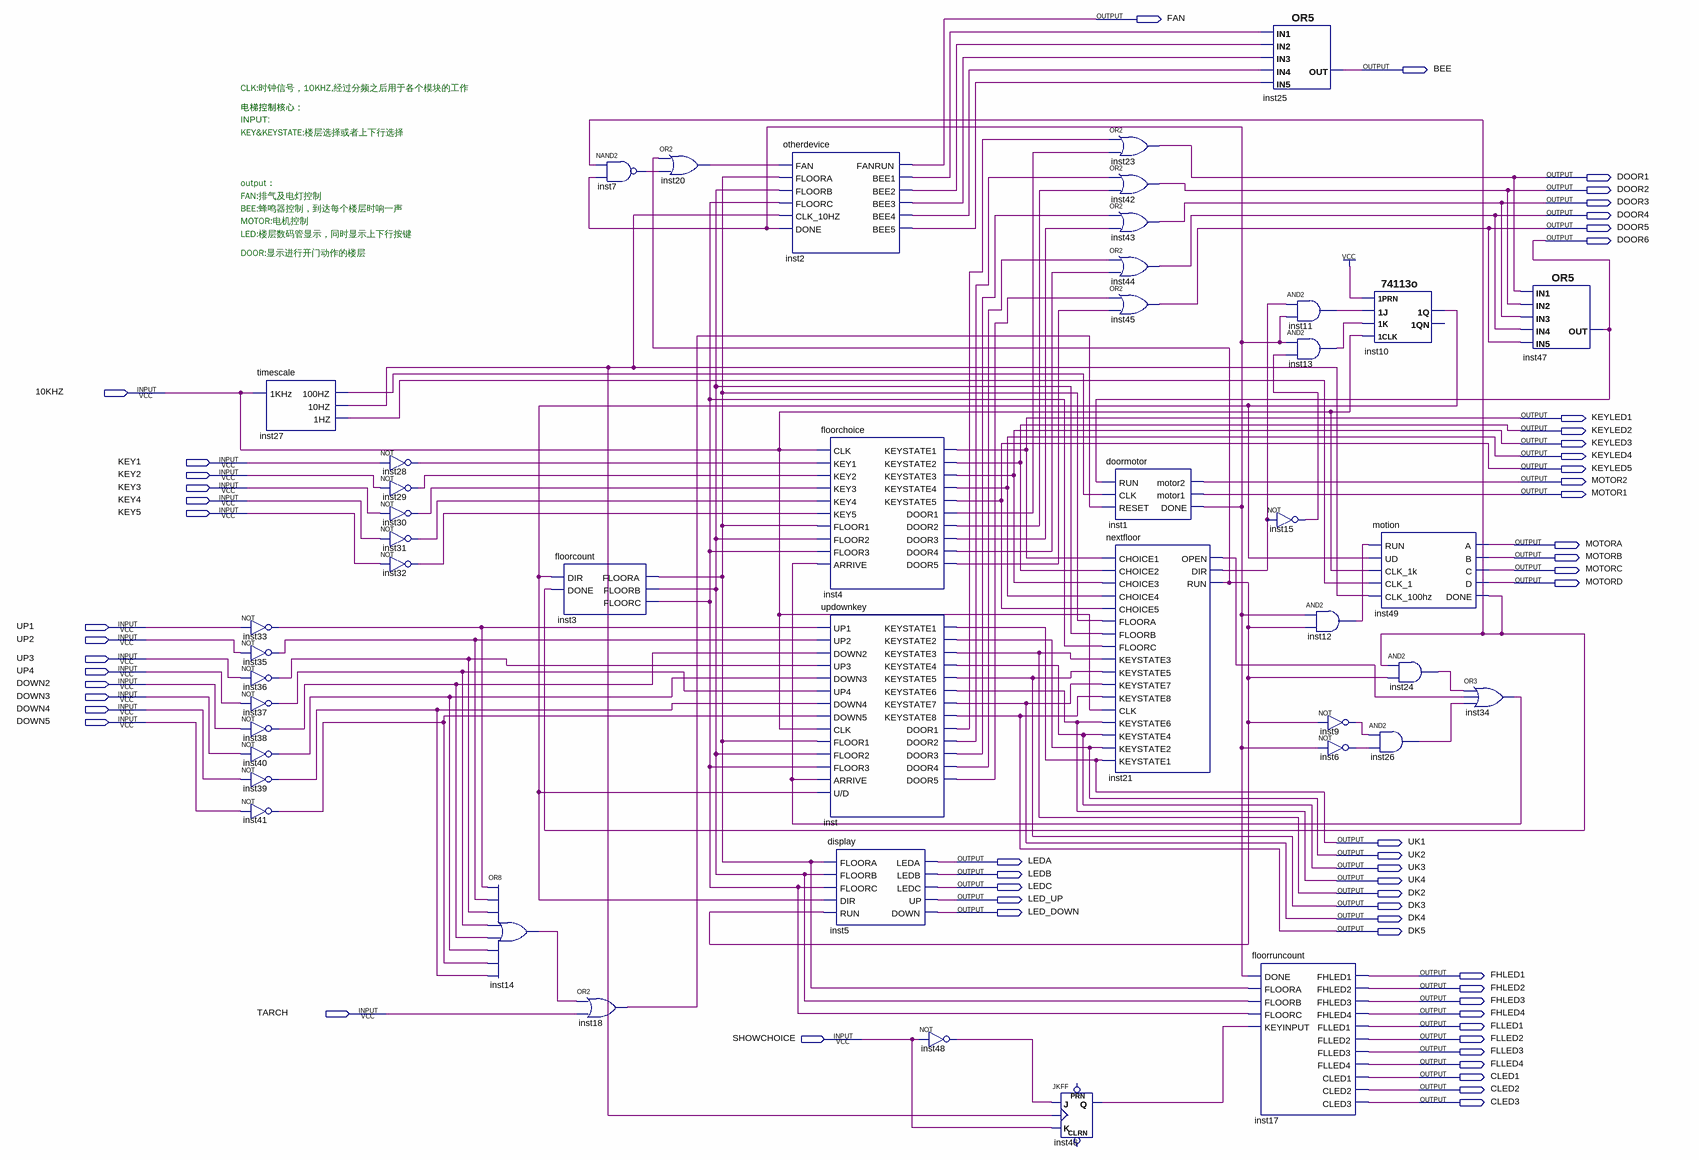
[diagram p0: schematic sheet]
// Quartus schematic elevator.bdf as structural Verilog: 46 symbols, 59 pins
module elevator (
  input  \10KHZ ,
  input  KEY1,
  input  KEY2,
  input  KEY3,
  input  KEY4,
  input  KEY5,
  input  UP1,
  input  UP2,
  input  UP3,
  input  UP4,
  input  DOWN2,
  input  DOWN3,
  input  DOWN4,
  input  DOWN5,
  input  TARCH,
  input  SHOWCHOICE,
  output FAN,
  output BEE,
  output DOOR1,
  output DOOR2,
  output DOOR3,
  output DOOR4,
  output DOOR5,
  output DOOR6,
  output KEYLED1,
  output KEYLED2,
  output KEYLED3,
  output KEYLED4,
  output KEYLED5,
  output MOTOR2,
  output MOTOR1,
  output MOTORA,
  output MOTORB,
  output MOTORC,
  output MOTORD,
  output UK1,
  output UK2,
  output LEDA,
  output UK3,
  output LEDB,
  output UK4,
  output LEDC,
  output DK2,
  output LED_UP,
  output DK3,
  output LED_DOWN,
  output DK4,
  output DK5,
  output FHLED1,
  output FHLED2,
  output FHLED3,
  output FHLED4,
  output FLLED1,
  output FLLED2,
  output FLLED3,
  output FLLED4,
  output CLED1,
  output CLED2,
  output CLED3
);

  wire inst1_done, inst2_bee1, inst2_bee2, inst2_bee3, inst2_bee4, inst2_bee5, inst3_floora, inst3_floorb,
       inst3_floorc, inst4_door1, inst4_door2, inst4_door3, inst4_door4, inst4_door5, inst6_out, inst7_out,
       inst9_out, inst10_1q, inst11_out, inst12_out, inst13_out, inst14_out, inst15_out, inst18_out,
       inst20_out, inst21_dir, inst21_open, inst21_run, inst24_out, inst26_out, inst27_1hz, inst27_10hz,
       inst27_100hz, inst28_out, inst29_out, inst30_out, inst31_out, inst32_out, inst33_out, inst34_out,
       inst35_out, inst36_out, inst37_out, inst38_out, inst39_out, inst40_out, inst41_out, inst46_q,
       inst48_out, inst49_done, inst_door1, inst_door2, inst_door3, inst_door4, inst_door5;

  timescale inst27 (.\1KHz (\10KHZ ), .\100HZ (inst27_100hz), .\10HZ (inst27_10hz), .\1HZ (inst27_1hz));
  not inst33 (inst33_out, UP1);
  not inst35 (inst35_out, UP2);
  not inst36 (inst36_out, UP3);
  not inst37 (inst37_out, UP4);
  not inst38 (inst38_out, DOWN2);
  not inst40 (inst40_out, DOWN3);
  not inst39 (inst39_out, DOWN4);
  not inst41 (inst41_out, DOWN5);
  not inst28 (inst28_out, KEY1);
  not inst29 (inst29_out, KEY2);
  not inst30 (inst30_out, KEY3);
  not inst31 (inst31_out, KEY4);
  not inst32 (inst32_out, KEY5);
  or inst14 (inst14_out, inst33_out, inst35_out, inst36_out, inst37_out, inst38_out, inst40_out, inst41_out, inst39_out);
  floorcount inst3 (
    .DIR(inst10_1q), .DONE(inst49_done), .FLOORA(inst3_floora), .FLOORB(inst3_floorb), .FLOORC(inst3_floorc));
  or inst18 (inst18_out, inst14_out, TARCH);
  nand inst7 (inst7_out, inst49_done, inst1_done);
  or inst20 (inst20_out, inst21_run, inst7_out);
  otherdevice inst2 (
    .FAN(inst20_out), .FLOORA(inst3_floora), .FLOORB(inst3_floorb), .FLOORC(inst3_floorc),
    .CLK_10HZ(inst27_10hz), .DONE(inst1_done), .FANRUN(FAN), .BEE1(inst2_bee1), .BEE2(inst2_bee2),
    .BEE3(inst2_bee3), .BEE4(inst2_bee4), .BEE5(inst2_bee5));
  floorchoice inst4 (
    .CLK(\10KHZ ), .KEY1(inst28_out), .KEY2(inst29_out), .KEY3(inst30_out), .KEY4(inst31_out),
    .KEY5(inst32_out), .FLOOR1(inst3_floora), .FLOOR2(inst3_floorb), .FLOOR3(inst3_floorc),
    .ARRIVE(inst34_out), .KEYSTATE1(KEYLED1), .KEYSTATE2(KEYLED2), .KEYSTATE3(KEYLED3), .KEYSTATE4(KEYLED4),
    .KEYSTATE5(KEYLED5), .DOOR1(inst4_door1), .DOOR2(inst4_door2), .DOOR3(inst4_door3), .DOOR4(inst4_door4),
    .DOOR5(inst4_door5));
  updownkey inst (
    .UP1(inst33_out), .UP2(inst35_out), .DOWN2(inst38_out), .UP3(inst36_out), .DOWN3(inst40_out),
    .UP4(inst37_out), .DOWN4(inst39_out), .DOWN5(inst41_out), .CLK(\10KHZ ), .FLOOR1(inst3_floora),
    .FLOOR2(inst3_floorb), .FLOOR3(inst3_floorc), .ARRIVE(inst34_out), .\U/D (inst10_1q), .KEYSTATE1(UK1),
    .KEYSTATE2(UK2), .KEYSTATE3(DK2), .KEYSTATE4(UK3), .KEYSTATE5(DK3), .KEYSTATE6(UK4), .KEYSTATE7(DK4),
    .KEYSTATE8(DK5), .DOOR1(inst_door1), .DOOR2(inst_door2), .DOOR3(inst_door3), .DOOR4(inst_door4),
    .DOOR5(inst_door5));
  display inst5 (
    .FLOORA(inst3_floora), .FLOORB(inst3_floorb), .FLOORC(inst3_floorc), .DIR(inst10_1q), .RUN(inst21_run),
    .LEDA(LEDA), .LEDB(LEDB), .LEDC(LEDC), .UP(LED_UP), .DOWN(LED_DOWN));
  not inst48 (inst48_out, SHOWCHOICE);
  JKFF inst46 (.K(SHOWCHOICE), .J(inst48_out), .CLK(inst27_10hz), .Q(inst46_q));  // open: PRN, CLRN
  or inst23 (DOOR1, inst_door1, inst4_door1);
  or inst42 (DOOR2, inst_door2, inst4_door2);
  or inst43 (DOOR3, inst_door3, inst4_door3);
  or inst44 (DOOR4, inst_door4, inst4_door4);
  or inst45 (DOOR5, inst_door5, inst4_door5);
  doormotor inst1 (
    .RUN(DOOR6), .CLK(inst27_100hz), .RESET(inst18_out), .motor2(MOTOR2), .motor1(MOTOR1), .DONE(inst1_done));
  nextfloor inst21 (
    .CHOICE1(KEYLED1), .CHOICE2(KEYLED2), .CHOICE3(KEYLED3), .CHOICE4(KEYLED4), .CHOICE5(KEYLED5),
    .FLOORA(inst3_floora), .FLOORB(inst3_floorb), .FLOORC(inst3_floorc), .KEYSTATE3(DK2), .KEYSTATE5(DK3),
    .KEYSTATE7(DK4), .KEYSTATE8(DK5), .CLK(\10KHZ ), .KEYSTATE6(UK4), .KEYSTATE4(UK3), .KEYSTATE2(UK2),
    .KEYSTATE1(UK1), .OPEN(inst21_open), .DIR(inst21_dir), .RUN(inst21_run));
  or inst25 (BEE, inst2_bee1, inst2_bee2, inst2_bee3, inst2_bee4, inst2_bee5);
  and inst11 (inst11_out, inst21_dir, inst1_done);
  and inst13 (inst13_out, inst1_done, inst15_out);
  not inst15 (inst15_out, inst21_dir);
  floorruncount inst17 (
    .DONE(inst1_done), .FLOORA(inst3_floora), .FLOORB(inst3_floorb), .FLOORC(inst3_floorc),
    .KEYINPUT(inst46_q), .FHLED1(FHLED1), .FHLED2(FHLED2), .FHLED3(FHLED3), .FHLED4(FHLED4), .FLLED1(FLLED1),
    .FLLED2(FLLED2), .FLLED3(FLLED3), .FLLED4(FLLED4), .CLED1(CLED1), .CLED2(CLED2), .CLED3(CLED3));
  and inst12 (inst12_out, inst1_done, inst21_run);
  not inst9 (inst9_out, inst21_run);
  not inst6 (inst6_out, inst1_done);
  \74113o  inst10 (
    .\1K (inst13_out), .\1J (inst11_out), .\1CLK (\10KHZ ), .\1PRN (1'b1), .\1Q (inst10_1q));  // open: 1QN
  motion inst49 (
    .RUN(inst12_out), .UD(inst10_1q), .CLK_1k(\10KHZ ), .CLK_1(inst27_1hz), .CLK_100hz(inst27_10hz),
    .A(MOTORA), .B(MOTORB), .C(MOTORC), .D(MOTORD), .DONE(inst49_done));
  and inst24 (inst24_out, inst49_done, inst21_run);
  and inst26 (inst26_out, inst9_out, inst6_out);
  or inst34 (inst34_out, inst24_out, inst21_open, inst26_out);
  or inst47 (DOOR6, DOOR1, DOOR2, DOOR3, DOOR4, DOOR5);

  // Notes on the sheet:
  //   CLK:时钟信号，10KHZ,经过分频之后用于各个模块的工作
  //   电梯控制核心：
  //   INPUT:
  //   KEY&KEYSTATE:楼层选择或者上下行选择
  //   output：
  //   FAN:排气及电灯控制
  //   BEE:蜂鸣器控制，到达每个楼层时响一声
  //   MOTOR:电机控制
  //   LED:楼层数码管显示，同时显示上下行按键
  //   DOOR:显示进行开门动作的楼层
endmodule
